# Altium schematic sheet ENABLE_MOSFETS.SchDoc
size A4
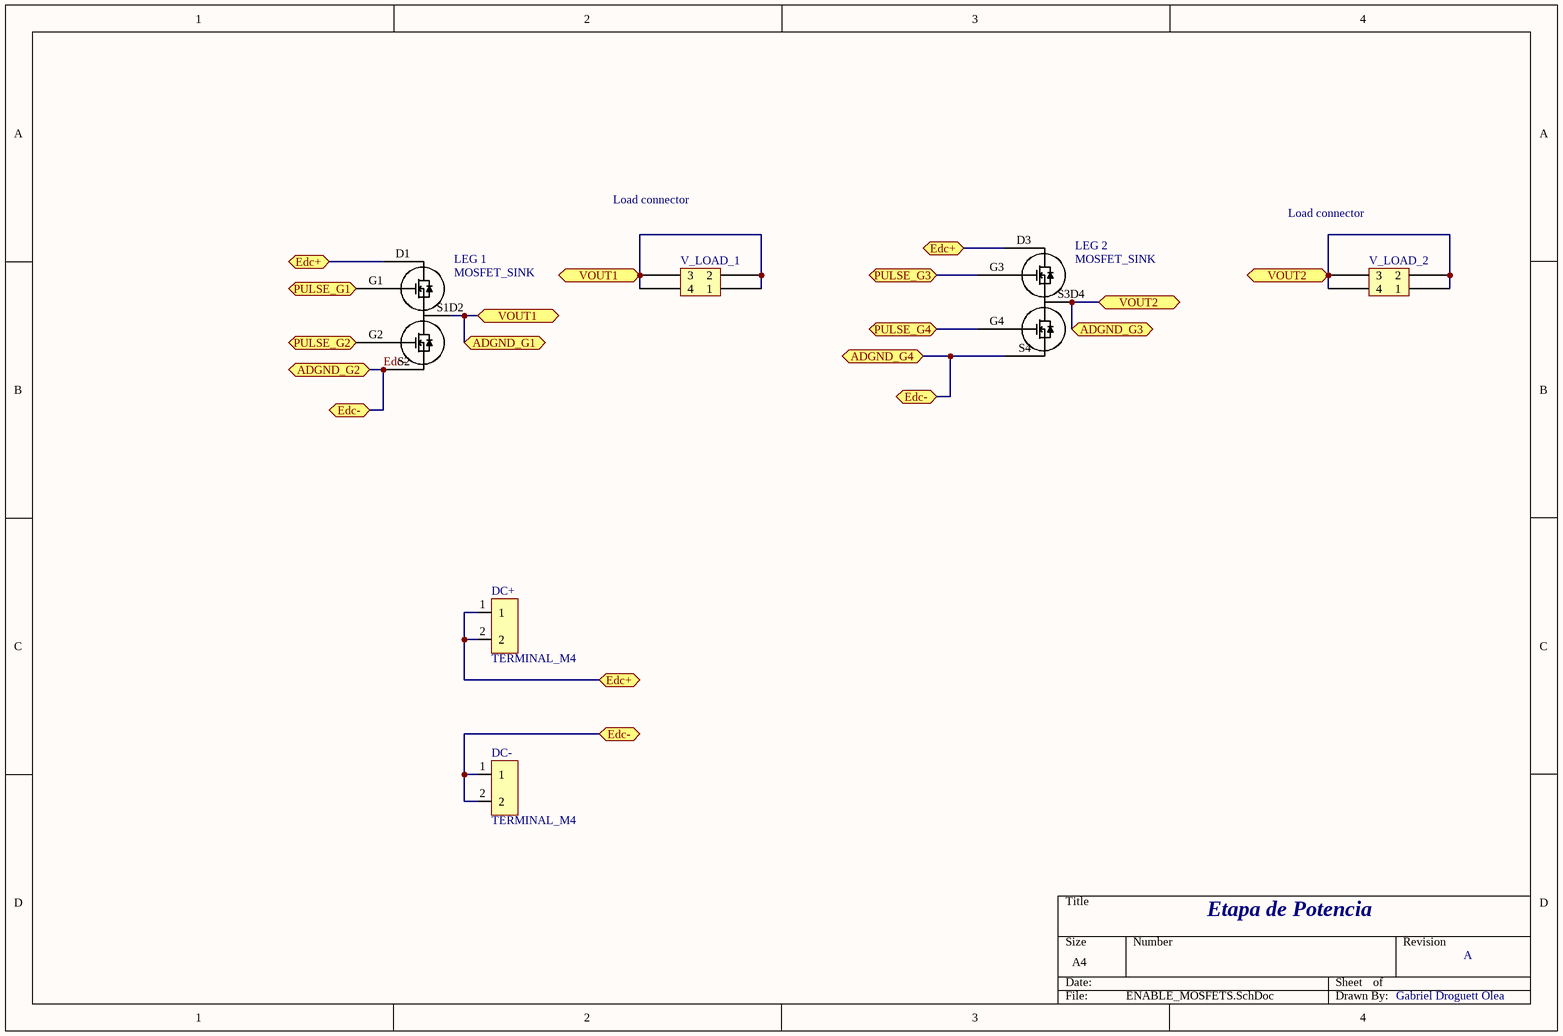
[diagram p0: ENABLE_MOSFETS.SchDoc]

## Parts
DC+  TERMINAL_M4  [m4_6pin_screw]
DC-  TERMINAL_M4  [m4_6pin_screw]
LEG_1  MOSFET_SINK  [MOSFET-TO247_LEG_1]
LEG_2  MOSFET_SINK  [MOSFET-TO247_LEG_2]
V_LOAD_1  CONN HEADER 4POS  [CONN HEADER 4POS]  (value not drawn)
V_LOAD_2  CONN HEADER 4POS  [CONN HEADER 4POS]  (value not drawn)

## Ports
ADGND_G1 (bidir), ADGND_G2 (bidir), ADGND_G3 (bidir), ADGND_G4 (bidir), Edc+ (bidir), Edc- (bidir), PULSE_G1 (bidir), PULSE_G2 (bidir), PULSE_G3 (bidir), PULSE_G4 (bidir), VOUT1 (bidir), VOUT2 (bidir)

## Nets
ADGND_G1: LEG_1.S1D2 V_LOAD_1.1 V_LOAD_1.2 V_LOAD_1.3 V_LOAD_1.4 ; port ADGND_G1, port VOUT1
ADGND_G3: LEG_2.S3D4 V_LOAD_2.1 V_LOAD_2.2 V_LOAD_2.3 V_LOAD_2.4 ; port ADGND_G3, port VOUT2
Edc+: DC+.1 DC+.2 LEG_1.D1 LEG_2.D3 ; port Edc+
Edc-: DC-.1 DC-.2 LEG_1.S2 LEG_2.S4 ; port Edc-, port ADGND_G2, port ADGND_G4
PULSE_G1: LEG_1.G1 ; port PULSE_G1
PULSE_G2: LEG_1.G2 ; port PULSE_G2
PULSE_G3: LEG_2.G3 ; port PULSE_G3
PULSE_G4: LEG_2.G4 ; port PULSE_G4

Not connected (* = marked no-connect by the designer): LEG_2 D1 G1 G2 S2

## Notes on the sheet
- Load connector
- Etapa de Potencia
- A
- Gabriel Droguett Olea

## Library data of the parts
DC+ DC- = CON_FASTON: CONN HEADER 4POS VERT W/O PEGS / CONN RECEPT 4POS FREE HANGING / CONN SOCKET 16AWG BRASS TIN (Agregar 4 al Part Number); Manufacturer Part Number: 1586037-4; Digi-Key Part Number: A30603-ND; RS Part Number: *; Digi-Key Part Number 2: A30591-ND; Digi-Key Part Number 3: A100459CT-ND; Manufacturer Part Number 2: 794954-4; Manufacturer Part Number 3: 1586055-1
LEG_1 = MOSFET_2_SINK_LEG_1: HEATSINK FOR TO-247 TO-264 / CAMMING CLIP FOR TO-247; Manufacturer Part Number: C40-058-VE; Digi-Key Part Number: C40-058-VE-ND; Digi-Key Part Number 2: CLA-T247-21E-ND; Manufacturer Part Number 2: CLA-T247-21E; RS Part Number: 893-5617; RS Part Number 2: *
LEG_2 = MOSFET_2_SINK_LEG_2: HEATSINK FOR TO-247 TO-264 / CAMMING CLIP FOR TO-247; Manufacturer Part Number: C40-058-VE; Digi-Key Part Number: C40-058-VE-ND; Digi-Key Part Number 2: CLA-T247-21E-ND; Manufacturer Part Number 2: CLA-T247-21E; RS Part Number: 893-5617; RS Part Number 2: *
V_LOAD_1 V_LOAD_2 = CONN HEADER 4POS: CONN HEADER 4POS VERT W/O PEGS /  CONN RECEPT 4POS FREE HANGING; Manufacturer Part Number: 64900429522; Digi-Key Part Number: 732-1933-ND; Digi-Key Part Number 2: 732-1943-ND; Manufacturer Part Number 2: 649004113322; RS Part Number: *; RS Part Number 2: *; Digi-Key Part Number 3: 732-4890-ND; Manufacturer Part Number 3: 64900513722DEC